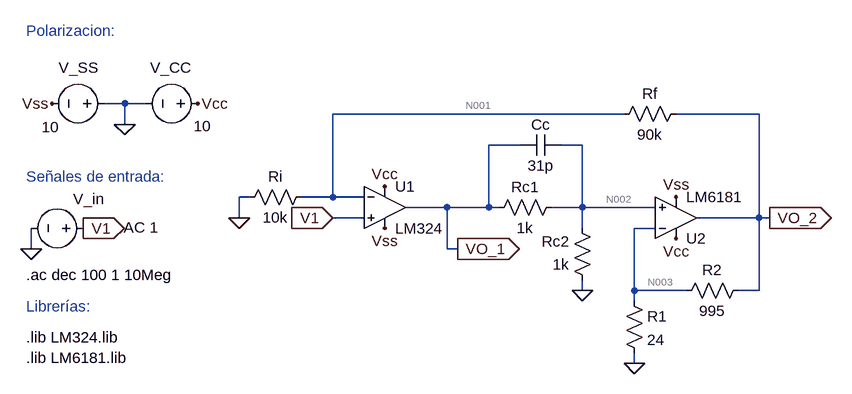
[diagram p0: schematic Lab_3_Circ_3-Respuesta en frecuencia.asc]
Lab_3_Circ_3-Respuesta en frecuencia.asc, the LTspice schematic file:
Version 4
SHEET 1 1652 680
WIRE 32 -256 0 -256
WIRE 64 -256 32 -256
WIRE 800 -240 352 -240
WIRE 1008 -240 880 -240
WIRE 32 -224 32 -256
WIRE 640 -192 592 -192
WIRE 736 -192 704 -192
WIRE 224 -112 208 -112
WIRE 352 -112 352 -240
WIRE 352 -112 304 -112
WIRE 400 -112 352 -112
WIRE 528 -96 464 -96
WIRE 592 -96 592 -192
WIRE 592 -96 528 -96
WIRE 608 -96 592 -96
WIRE 736 -96 736 -192
WIRE 736 -96 688 -96
WIRE 848 -96 736 -96
WIRE 208 -80 208 -112
WIRE 400 -80 352 -80
WIRE 1008 -80 1008 -240
WIRE 1008 -80 912 -80
WIRE 1024 -80 1008 -80
WIRE 736 -64 736 -96
WIRE 848 -64 816 -64
WIRE -112 -32 -112 -64
WIRE 528 -32 528 -96
WIRE 544 -32 528 -32
WIRE 736 32 736 16
WIRE 816 32 816 -64
WIRE 896 32 816 32
WIRE 1008 32 1008 -80
WIRE 1008 32 976 32
WIRE 816 48 816 32
WIRE 816 144 816 128
FLAG 816 144 0
FLAG 144 -256 Vcc
FLAG 432 -128 Vcc
FLAG -80 -256 Vss
FLAG 432 -64 Vss
FLAG 32 -224 0
FLAG -112 -32 0
FLAG 352 -80 V1
IOPIN 352 -80 In
FLAG -32 -64 V1
IOPIN -32 -64 Out
FLAG 1024 -80 VO_2
IOPIN 1024 -80 Out
FLAG 880 -48 Vcc
FLAG 880 -112 Vss
FLAG 208 -80 0
FLAG 544 -32 VO_1
IOPIN 544 -32 Out
FLAG 736 32 0
SYMBOL OpAmps\\opamp2 432 -160 R0
SYMATTR InstName U1
SYMATTR Value LM324
SYMBOL res 800 32 R0
SYMATTR InstName R1
SYMATTR Value 24
SYMBOL res 880 48 R270
WINDOW 0 32 56 VTop 2
WINDOW 3 0 56 VBottom 2
SYMATTR InstName R2
SYMATTR Value 995
SYMBOL res 896 -256 R90
WINDOW 0 0 56 VBottom 2
WINDOW 3 32 56 VTop 2
SYMATTR InstName Rf
SYMATTR Value 90k
SYMBOL res 208 -96 R270
WINDOW 0 32 56 VTop 2
WINDOW 3 0 56 VBottom 2
SYMATTR InstName Ri
SYMATTR Value 10k
SYMBOL voltage -16 -64 M270
WINDOW 0 45 31 VLeft 2
WINDOW 3 1 -53 VLeft 2
WINDOW 123 1 -46 VLeft 2
WINDOW 39 0 0 Left 0
SYMATTR InstName V_in
SYMATTR Value ""
SYMATTR Value2 AC 1
SYMBOL voltage 160 -256 R90
WINDOW 0 -55 25 VRight 2
WINDOW 3 35 -5 VRight 2
WINDOW 123 0 0 Left 0
WINDOW 39 0 0 Left 0
SYMATTR InstName V_CC
SYMATTR Value 10
SYMBOL voltage 16 -256 R90
WINDOW 0 -55 25 VRight 2
WINDOW 3 36 85 VRight 2
WINDOW 123 0 0 Left 0
WINDOW 39 0 0 Left 0
SYMATTR InstName V_SS
SYMATTR Value 10
SYMBOL OpAmps\\opamp2 880 -16 M180
SYMATTR InstName U2
SYMATTR Value LM6181
SYMBOL res 704 -112 R90
WINDOW 0 0 56 VBottom 2
WINDOW 3 32 56 VTop 2
SYMATTR InstName Rc1
SYMATTR Value 1k
SYMBOL res 752 32 R180
WINDOW 0 36 76 Left 2
WINDOW 3 36 40 Left 2
SYMATTR InstName Rc2
SYMATTR Value 1k
SYMBOL cap 704 -208 R90
WINDOW 0 0 32 VBottom 2
WINDOW 3 32 32 VTop 2
SYMATTR InstName Cc
SYMATTR Value 31p
TEXT -120 104 Left 2 !.lib LM324.lib\n.lib LM6181.lib
TEXT -120 56 Left 2 ;Librerías:
TEXT -120 -368 Left 2 ;Polarizacion:
TEXT -120 -144 Left 2 ;Señales de entrada:
TEXT -120 8 Left 2 !.ac dec 100 1 10Meg

The netlist it stands for:
* Lab_3_Circ_3-Respuesta en frecuencia.asc
XU1 V1 N001 Vcc Vss VO_1 LM324  ; pins In+ In- V+ V- OUT
R1 N003 0 24
R2 N003 VO_2 995
Rf VO_2 N001 90k
Ri 0 N001 10k
V_in V1 0 AC 1
V_CC Vcc 0 10
V_SS 0 Vss 10
XU2 N002 N003 Vcc Vss VO_2 LM6181  ; pins In+ In- V+ V- OUT
Rc1 N002 VO_1 1k
Rc2 0 N002 1k
Cc N002 VO_1 31p
.lib LM324.lib
.lib LM6181.lib
* Librerías:
* Polarizacion:
* Señales de entrada:
.ac dec 100 1 10Meg
.backanno
.end

* Results of the author's LTspice run, read from the files saved beside the schematic
* Operating Point, zero values left out:
*   V(vo_1) = -3.543 mV
*   V(vss) = -10 V
*   V(vcc) = 10 V
*   V(n001) = -33.62 µV
*   V(n003) = 78.69 µV
*   V(vo_2) = -2.131 mV
*   V(n002) = -2.321 mV
*   I(Rc2) = 2.321 µA
*   I(Rc1) = 1.222 µA
*   I(Ri) = 3.362 nA
*   I(Rf) = -23.3 nA
*   I(R2) = 2.221 µA
*   I(R1) = 3.279 µA
*   I(V_ss) = -7.424 mA
*   I(V_cc) = -7.426 mA
*   I(V_in) = 19.92 nA
*   Ix(u1:1) = -19.92 nA
*   Ix(u1:2) = -19.94 nA
*   Ix(u1:3) = 669.9 µA
*   Ix(u1:4) = -669.8 µA
*   Ix(u1:5) = 1.222 µA
*   Ix(u2:1) = 1.1 µA
*   Ix(u2:2) = -5.499 µA
*   Ix(u2:99) = 6.756 mA
*   Ix(u2:50) = -6.754 mA
*   Ix(u2:41) = 2.244 µA
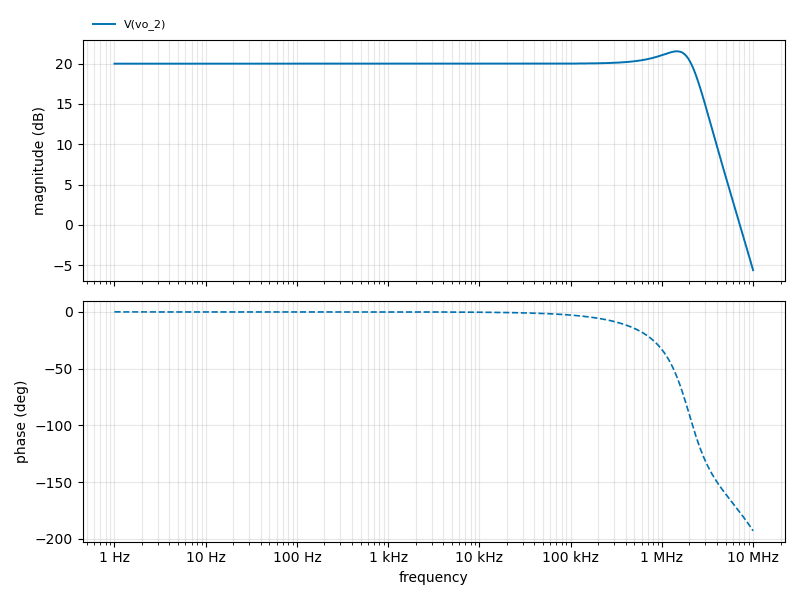
[diagram p1: AC Analysis of Lab_3_Circ_3-Respuesta en frecuencia.asc, plotted from the saved traces]
* AC Analysis, 1 run:
*   V(vo_2): 20.00 dB at 1 Hz, -5.61 dB at 10 MHz, peak 21.54 dB at 1.479 MHz, 3 dB below the peak at 2.372 MHz